# Altium project Eload Aux Supply Module Rev 2.PrjPcb
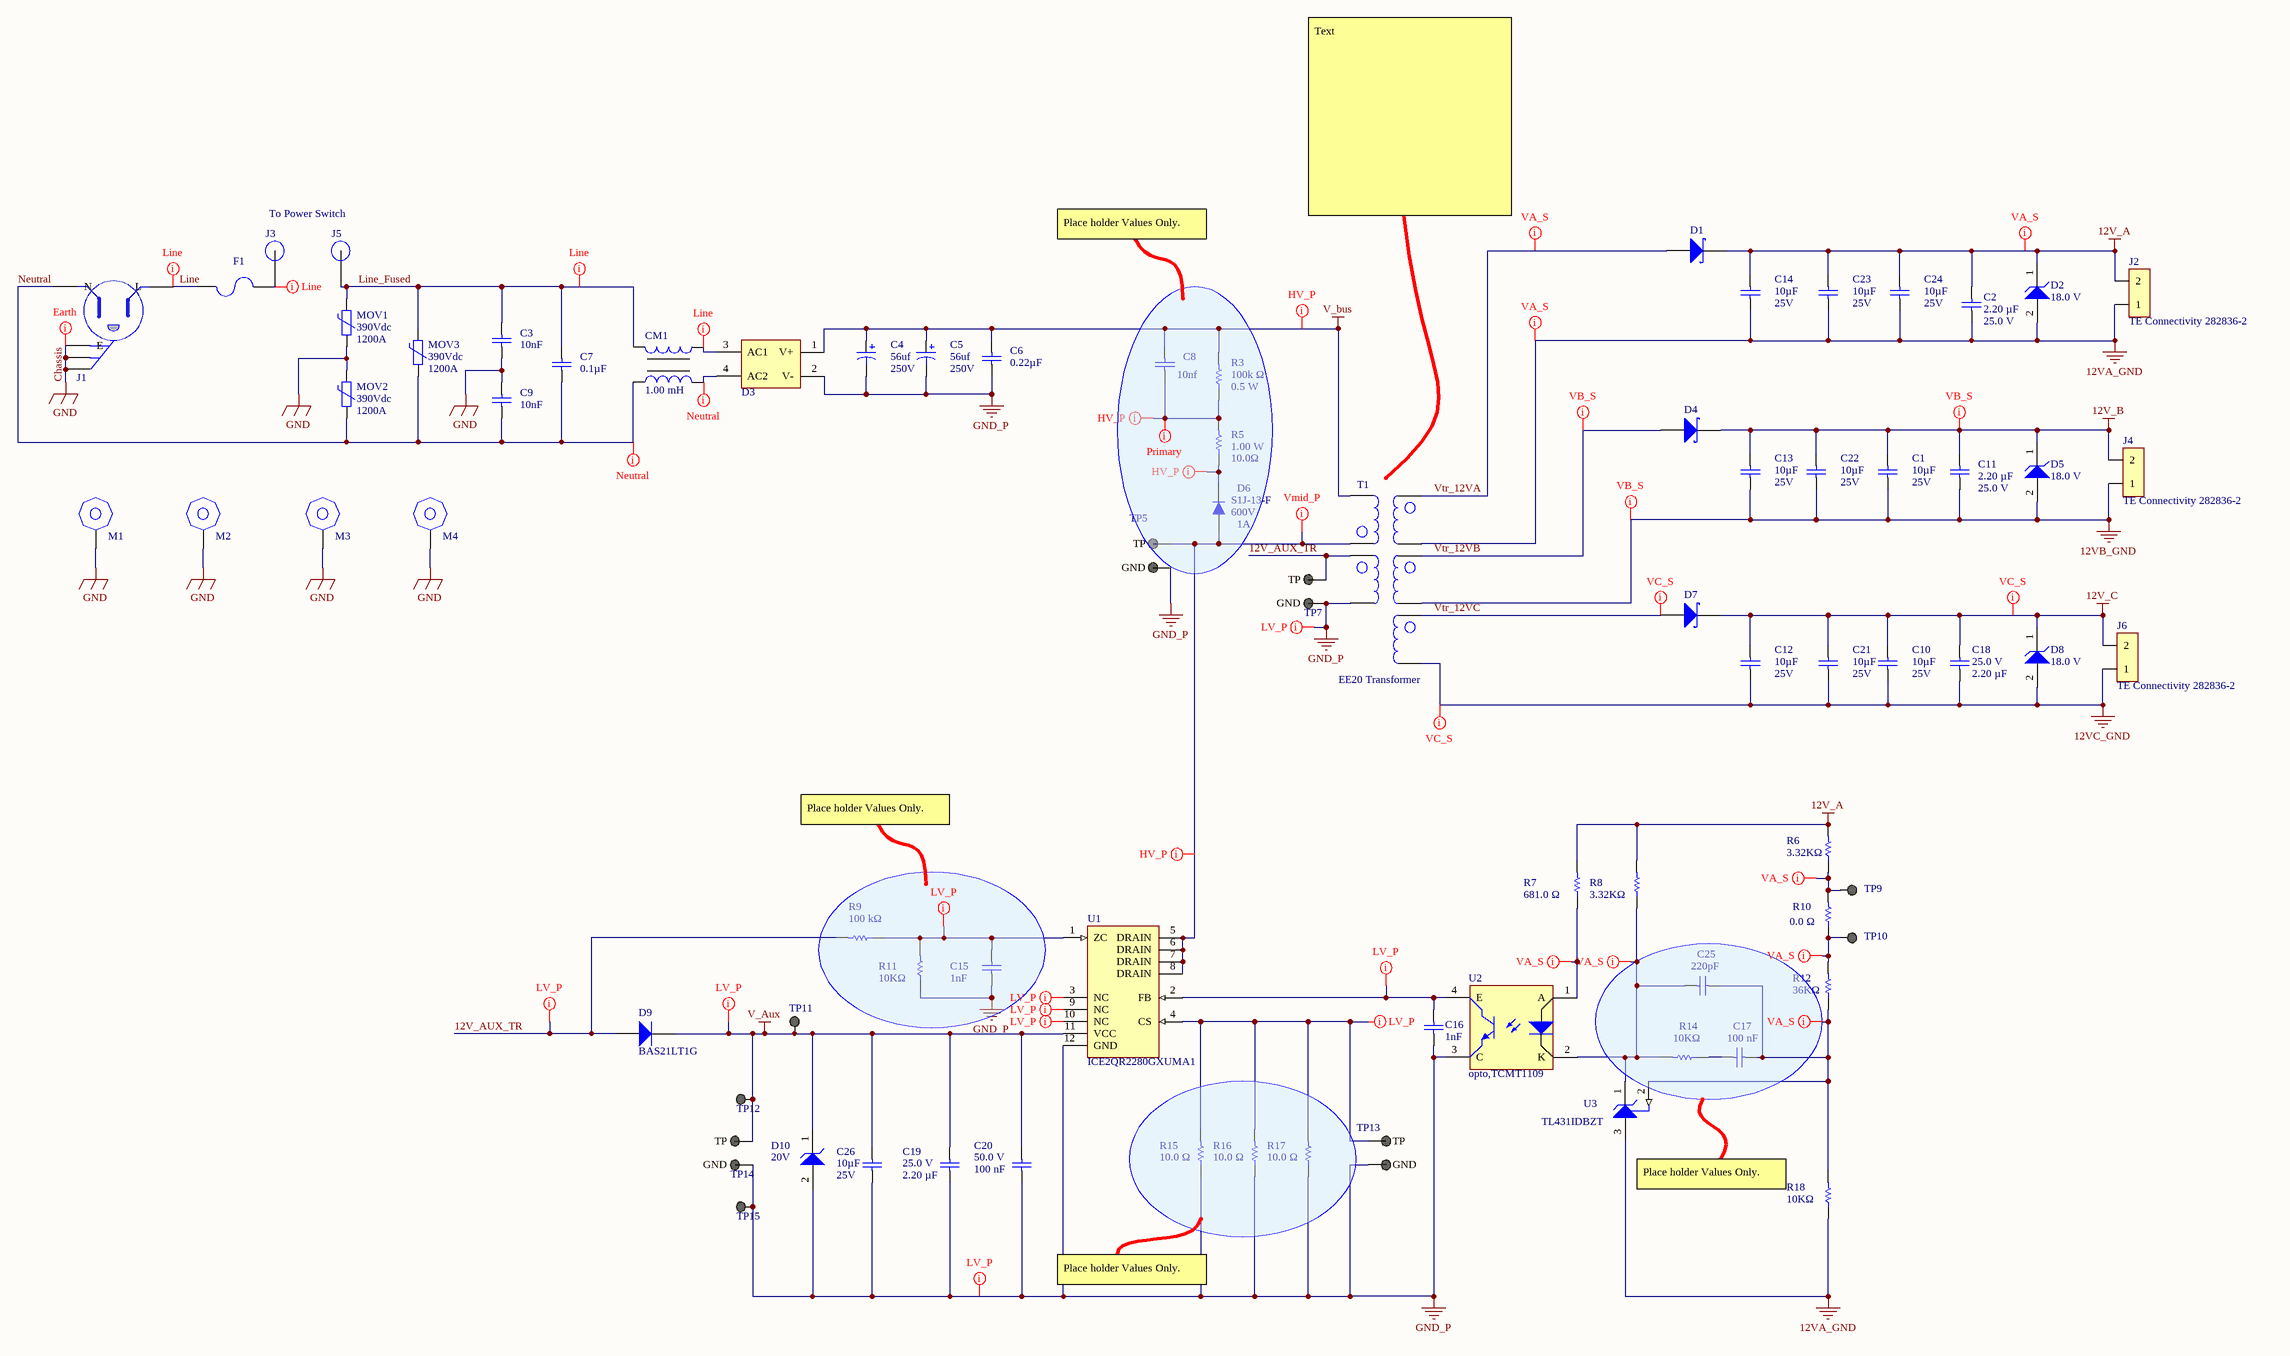
[diagram p0: Eload Aux Supply Module Rev 2.SchDoc]
1 sheet, 78 parts. Net scope: global (net labels, ports and power ports of the same name join across sheets).

## Sheet Eload Aux Supply Module Rev 2.SchDoc
size C

### Parts
C1  Capacitance: 10µF  Voltage - Rated: 25V  [Cap, 1206]  (hidden comment: Cap)
C2  Voltage Rating (DC): 25.0 V  Capacitance: 2.20 µF  [CAP, 0805, HD]  (hidden comment: AVX 08053C225KAT2A)
C3  Capacitance: 10nF  [Cap,7.5mm,RFI]  (hidden comment: Cap)
C4  Cap: 56uf  Voltage rating: 250V  [Cap, Rad, 5mmLead,12.5mmDia,Pin 2+]  (hidden comment: Cap,polar,through hole,12.5mm,56uf,250V,20%,UCY2E560MHD1TO)
C5  Cap: 56uf  Voltage rating: 250V  [Cap, Rad, 5mmLead,12.5mmDia,Pin 2+]  (hidden comment: Cap,polar,through hole,12.5mm,56uf,250V,20%,UCY2E560MHD1TO)
C6  Capacitance: 0.22µF  [Cap, 5mm Lead Spaceing, 4mm dai]  (hidden comment: Cap)
C7  Capacitance: 0.1µF  [CAP,RFI,15mm Lead Spaceing]  (hidden comment: Cap)
C8  10nf  [Cap, 5mm Lead Spaceing, 4mm dai]
C9  Capacitance: 10nF  [Cap,7.5mm,RFI]  (hidden comment: Cap)
C10  Capacitance: 10µF  Voltage - Rated: 25V  [Cap, 1206]  (hidden comment: Cap)
C11  Voltage Rating (DC): 25.0 V  Capacitance: 2.20 µF  [CAP, 0805, HD]  (hidden comment: AVX 08053C225KAT2A)
C12  Capacitance: 10µF  Voltage - Rated: 25V  [Cap, 1206]  (hidden comment: Cap)
C13  Capacitance: 10µF  Voltage - Rated: 25V  [Cap, 1206]  (hidden comment: Cap)
C14  Capacitance: 10µF  Voltage - Rated: 25V  [Cap, 1206]  (hidden comment: Cap)
C15  Capacitance: 1nF  [CAP, 0805, HD]  (hidden comment: Kemet C0805X102J1GACAUTO)
C16  Capacitance: 1nF  [CAP, 0805, HD]  (hidden comment: Kemet C0805X102J1GACAUTO)
C17  Capacitance: 100 nF  [CAP, 0805, HD]  (hidden comment: 08055C104JAT2A)
C18  Voltage Rating (DC): 25.0 V  Capacitance: 2.20 µF  [CAP, 0805, HD]  (hidden comment: AVX 08053C225KAT2A)
C19  Voltage Rating (DC): 25.0 V  Capacitance: 2.20 µF  [CAP, 0805, HD]  (hidden comment: AVX 08053C225KAT2A)
C20  Voltage Rating (DC): 50.0 V  Capacitance: 100 nF  [CAP, 0805, HD]  (hidden comment: 08055C104JAT2A)
C21  Capacitance: 10µF  Voltage - Rated: 25V  [Cap, 1206]  (hidden comment: Cap)
C22  Capacitance: 10µF  Voltage - Rated: 25V  [Cap, 1206]  (hidden comment: Cap)
C23  Capacitance: 10µF  Voltage - Rated: 25V  [Cap, 1206]  (hidden comment: Cap)
C24  Capacitance: 10µF  Voltage - Rated: 25V  [Cap, 1206]  (hidden comment: Cap)
C25  Capacitance: 220pF  [CAP, 0805, HD]  (hidden comment: CC0805KRX7R9BB221)
C26  Capacitance: 10µF  Voltage - Rated: 25V  [Cap, 1206]  (hidden comment: Cap)
CM1  Inductance: 1.00 mH  [Common mode inductor,TLF9UA102W0R8K1]  (hidden comment: KEMET SC-03-10G)
D1  NRVTSA4100ET3G  [DO-214AC, SMA]  (value not drawn)
D2  Voltage Rating (DC): 18.0 V  [SOD123]  (hidden comment: MMSZ4705T1G)
D3  Diode,Bridge, micro-dip,1A,600V, MDB6S  [Micro-DIP, 4-Leads]  (value not drawn)
D4  NRVTSA4100ET3G  [DO-214AC, SMA]  (value not drawn)
D5  Voltage Rating (DC): 18.0 V  [SOD123]  (hidden comment: MMSZ4705T1G)
D6  Manufacturer Part Number: S1J-13-F  Voltage - DC Reverse (Vr) (Max): 600V  Current: 1A  [DO-214AC, SMA]  (hidden comment: Diodes Inc. S1J-13-F)
D7  NRVTSA4100ET3G  [DO-214AC, SMA]  (value not drawn)
D8  Voltage Rating (DC): 18.0 V  [SOD123]  (hidden comment: MMSZ4705T1G)
D9  BAS21LT1G  [SOT23-3]
D10  Voltage - Zener (Nom) (Vz): 20V  [SOD123]  (hidden comment: MMSZ5250BT1G)
F1  Littelfuse 0461.500ER  [Fuse chip, SMD,9.4mm]  (value not drawn)
J1  Qualtek 703W-00/54  [conn, IEC320,703W-00/54]  (value not drawn)
J2  TE Connectivity 282836-2  [TERM BLOCK 2POS SIDE ENTRY 5MM]
J3  Wire Terminal,Quick connect, through hole, Keystone 1287-ST  [Quick connect terminal]  (value not drawn)
J4  TE Connectivity 282836-2  [TERM BLOCK 2POS SIDE ENTRY 5MM]
J5  Wire Terminal,Quick connect, through hole, Keystone 1287-ST  [Quick connect terminal]  (value not drawn)
J6  TE Connectivity 282836-2  [TERM BLOCK 2POS SIDE ENTRY 5MM]
M1  M3 hex Standoff  [Standoff,Hex,M3,8mm]  (value not drawn)
M2  M3 hex Standoff  [Standoff,Hex,M3,8mm]  (value not drawn)
M3  M3 hex Standoff  [Standoff,Hex,M3,8mm]  (value not drawn)
M4  M3 hex Standoff  [Standoff,Hex,M3,8mm]  (value not drawn)
MOV1  DC Clamping Voltage: 390Vdc  Clamping Current: 1200A  [MOV, 5mm spacing]  (hidden comment: MOV, though hole, 390V, 1.2kA, B72207S0251K101)
MOV2  DC Clamping Voltage: 390Vdc  Clamping Current: 1200A  [MOV, 5mm spacing]  (hidden comment: MOV, though hole, 390V, 1.2kA, B72207S0251K101)
MOV3  DC Clamping Voltage: 390Vdc  Clamping Current: 1200A  [MOV, 5mm spacing]  (hidden comment: MOV, though hole, 390V, 1.2kA, B72207S0251K101)
R3  Power Rating: 0.5 W  Resistance: 100k Ω  [Res,1210]  (hidden comment: Panasonic ERJ-14NF1003U)
R5  Power Rating: 1.00 W  Resistance: 10.0Ω  [Resistor,2010,1W]  (hidden comment: Bourns CRS2010-JX-100ELF)
R6  Resistance: 3.32KΩ  [res, 0805, HD]  (hidden comment: Vishay Dale CRCW08053K32FKEA)
R7  Resistance: 681.0 Ω  [res, 0805, HD]  (hidden comment: Vishay Dale CRCW0805681RFKEA)
R8  Resistance: 3.32KΩ  [res, 0805, HD]  (hidden comment: Vishay Dale CRCW08053K32FKEA)
R9  Resistance: 100 kΩ  [res, 0805, HD]  (hidden comment: Res,0805,100kΩ,1%,100ppm,CRCW0805100KFKEA)
R10  Resistance: 0.0 Ω  [res, 0805, HD]  (hidden comment: Vishay Dale CRCW08050000Z0EAHP)
R11  Resistance: 10KΩ  [res, 0805, HD]  (hidden comment: Vishay / Dale CRCW080510K0FKTA)
R12  Resistance: 36KΩ  [res, 0805, HD]  (hidden comment: Vishay Dale CRCW080536K0FKEA)
R14  Resistance: 10KΩ  [res, 0805, HD]  (hidden comment: Vishay / Dale CRCW080510K0FKTA)
R15  Resistance: 10.0 Ω  [Res,1210]  (hidden comment: RP73D2B10RBTG)
R16  Resistance: 10.0 Ω  [Res,1210]  (hidden comment: RP73D2B10RBTG)
R17  Resistance: 10.0 Ω  [Res,1210]  (hidden comment: RP73D2B10RBTG)
R18  Resistance: 10KΩ  [res, 0805, HD]  (hidden comment: Vishay / Dale CRCW080510K0FKTA)
T1  EE20 Transformer  [Transformer EE20, 10 Pos]
TP5  Scope Probe TP  [ScopeProbe_TP-Tektronix]  (value not drawn)  (no BOM)
TP7  Scope Probe TP  [ScopeProbe_TP-Tektronix]  (value not drawn)  (no BOM)
TP9  Keystone 5014  [Test Point, Keystone 5014]  (value not drawn)
TP10  Keystone 5014  [Test Point, Keystone 5014]  (value not drawn)
TP11  Keystone 5014  [Test Point, Keystone 5014]  (value not drawn)
TP12  Keystone 5014  [Test Point, Keystone 5014]  (value not drawn)
TP13  Scope Probe TP  [ScopeProbe_TP-Tektronix]  (value not drawn)  (no BOM)
TP14  Scope Probe TP  [ScopeProbe_TP-Tektronix]  (value not drawn)  (no BOM)
TP15  Keystone 5014  [Test Point, Keystone 5014]  (value not drawn)
U1  mfg P/N: ICE2QR2280GXUMA1  [SOP, 16-Leads]  (hidden comment: Infineon ICE2QR2280GXUMA1)
U2  opto,TCMT1109  [SSOP, 4-Leads]
U3  Manufacturer Part Number: TL431IDBZT  [SOT23-3]  (hidden comment: Shunt Regulator,2.5Vdc TL431IDBZT)

### Nets
12V_A: C2.2 C14.2 C23.2 C24.2 D1.1(K) D2.1(K) J2.2 R6.2 R7.2 R8.2
12V_B: C1.2 C11.2 C13.2 C22.2 D4.1(K) D5.1(K) J4.2
12V_C: C10.2 C12.2 C18.2 C21.2 D7.1(K) D8.1(K) J6.2
12VA_GND: C2.1 C14.1 C23.1 C24.1 D2.2(A) J2.1 R18.1 T1.5 U3.3(ANODE)
12VB_GND: C1.1 C11.1 C13.1 C22.1 D5.2(A) J4.1 T1.7
12VC_GND: C10.1 C12.1 C18.1 C21.1 D8.2(A) J6.1 T1.9
Chassis: C3.1 C9.2 J1.2(E) J1.4(E) J1.5(E) M1.0 M2.0 M3.0 M4.0 MOV1.1 MOV2.2  [also labelled GND]
GND_P: C4.1 C5.1 C6.1 C15.1 C16.1 C19.1 C20.1 C26.1 D3.2(V-) D10.2(A) R11.1 R15.1 R16.1 R17.1 T1.4 TP5.1(GND) TP7.1(GND) TP13.1(GND) TP14.1(GND) TP15.1 U1.12(GND) U2.3(C)
V_Aux: C19.2 C20.2 C26.2 D9.3(K) D10.1(K) TP11.1 TP12.1 TP14.2(TP) U1.11(VCC)
V_bus: C4.2 C5.2 C6.2 C8.2 D3.1(V+) R3.2 T1.1
12V_AUX_TR: D9.1(A) R9.2 T1.3 TP7.2(TP)
Line: F1.1 J1.1(L)
Line_Fused: C3.2 C7.2 CM1.3 J5.1 MOV1.2 MOV3.2
Neutral: C7.1 C9.1 CM1.1 J1.3(N) MOV2.1 MOV3.1
Vtr_12VA: D1.2(A) T1.6
Vtr_12VB: D4.2(A) T1.8
Vtr_12VC: D7.2(A) T1.10
NetC8_1: C8.1 R3.1 R5.2
NetC15_2: C15.2 R9.1 R11.2 U1.1(ZC)
NetC16_2: C16.2 U1.2(FB) U2.4(E)
NetC17_1: C17.1 C25.2 R12.1 R18.2 U3.2(REF)
NetC17_2: C17.2 R14.1
NetC25_1: C25.1 R8.1 R14.2 U2.2(K) U3.1(CATHODE)
NetCM1_2: CM1.2 D3.3(AC1)
NetCM1_4: CM1.4 D3.4(AC2)
NetD6_1: D6.1(A) T1.2 TP5.2(TP) U1.5(DRAIN) U1.6(DRAIN) U1.7(DRAIN) U1.8(DRAIN)
NetD6_2: D6.2(K) R5.1
NetF1_2: F1.2 J3.1
NetR6_1: R6.1 R10.2 TP9.1
NetR7_1: R7.1 U2.1(A)
NetR10_1: R10.1 R12.2 TP10.1
NetR15_2: R15.2 R16.2 R17.2 TP13.2(TP) U1.4(CS)

Not connected (* = marked no-connect by the designer): U1 3(NC) 9(NC) 10(NC)

### Layout directives
net class HV_P; net class Primary: NetC8_1, NetD6_1, NetD6_2, V_bus
net class LV_P; net class Primary: 12V_AUX_TR, GND_P, NetC15_2, NetC16_2, NetR15_2, NetU1_3, NetU1_9, NetU1_10, V_Aux
net class VB_S; net class Secondary: 12V_B, 12VB_GND, Vtr_12VB
net class VA_S; net class Secondary: 12V_A, 12VA_GND, NetC17_1, NetC25_1, NetR6_1, NetR7_1, NetR10_1, Vtr_12VA
net class Neutral; net class Primary; : Pri_Power: Neutral
net class VC_S; net class Secondary: 12V_C, 12VC_GND, Vtr_12VC
net class Primary; net class Primary: NetC8_1
net class Earth; net class Primary: Chassis
net class Vmid_P; net class Primary: NetD6_1
net class Line; net class Primary: NetCM1_2
net class Neutral; net class Primary: NetCM1_4
net class Line; net class Primary; net class Pri_Power: Line, Line_Fused, NetF1_2

### Notes on the sheet
- Text
- To Power Switch
- Place holder Values Only.

### Library data of the parts
C1 C10 C12-C14 C21-C24 C26 = CAP,1206,10uF,25V,C3216X7R1E106K160AB: 10µF ±10% 25V Ceramic Capacitor X7R 1206 (3216 Metric); Manufacturer: TDK Corporation; Features Low: ESL; mfg P/N: C3216X7R1E106K160AB; Tolerance: ±10%; Temperature Coefficient: X7R; Operating Temperature: -55°C ~ 125°C; Applications: General Purpose; Mounting Type: Surface Mount, MLCC; Package / Case: 1206 (3216 Metric); Size / Dimension: 0.126" L x 0.063" W (3.20mm x 1.60mm); Thickness (Max): 0.075" (1.90mm)
C2 C11 C18 C19 = Cap,0805,2.2uF,25V,±10%: 0805 2.2 uF 25 V ±10 % Tolerance X7R SMT Multilayer Ceramic Capacitor; Lead-Free Status: Lead Free; Case/Package (SI): 2012; Capacitance Tolerance: ±10%; REACH SVHC Compliance: No SVHC; Manufacturer Part Number: 08053C225KAT2A; Octopart URL: http://octopart.com/08053c225kat2a-avx-46506595; Case/Package: 0805; Mounting Style: Surface Mount; Dielectric Characteristic: X7R; RoHS: Compliant; Packaging: Cut Tape (CT), Tape & Reel (TR); Number of Pins: 2
C3 C9 = Cap,RFI,TH,7.5mm,10nF,300Vac,10nF,DE2F3KY103MN3AU02F: 10000pF ±20% 300VAC Ceramic Capacitor F Radial, Disc; Manufacturer: Murata Electronics North America; Ratings: X1, Y2; mfg P/N: DE2F3KY103MN3AU02F; Tolerance: ±20%; Voltage - Rated: 300VAC; Temperature Coefficient: F; Operating Temperature: -40°C ~ 125°C; Applications: Safety; Mounting Type: Through Hole; Package / Case: Radial, Disc; Size / Dimension: 0.551" Dia (14.00mm); Height - Seated (Max): 0.669" (17.00mm); Lead Spacing: 0.295" (7.50mm); Lead Style: Formed Leads
C4 C5 = Cap,polar,through hole,12.5mm,56uf,250V,20%,UCY2E560MHD1TO: Cap Alum 56uf 20% 250v Radial; Manufacturer Part Number: UCY2E560MHD1TO
C6 = Cap,TH,General Putpose,5mm Spacing, 220nF,250V,FG20X7R2E224KNT06: 0.22µF ±10% 250V Ceramic Capacitor X7R Radial; Manufacturer: TDK Corporation; mfg P/N: FG20X7R2E224KNT06; Tolerance: ±10%; Voltage - Rated: 250V; Temperature Coefficient: X7R; Operating Temperature: -55°C ~ 125°C; Applications: General Purpose; Mounting Type: Through Hole; Package / Case: Radial; Size / Dimension: 0.217" L x 0.157" W (5.50mm x 4.00mm); Height - Seated (Max): 0.276" (7.00mm); Lead Spacing: 0.197" (5.00mm); Lead Style: Formed Leads - Kinked
C7 = Cap,RFI,TH,15mm,100nF,305VAC,20%, B32922C3104M000: 0.1µF Film Capacitor 305V 630V Polypropylene (PP) Radial; Manufacturer: EPCOS (TDK); Tolerance: ±20%; Ratings: X2; mfg P/N: B32922C3104M000; Voltage Rating - AC: 305V; Voltage Rating - DC: 630V; Dielectric Material: Polypropylene (PP); Operating Temperature: O-40°C ~ 110°C; Mounting Type: Through Hole; Package / Case: Radial; Size / Dimension: 0.709" L x 0.197" W (18.00mm x 5.00mm); Height - Seated (Max): 0.413" (10.50mm); Termination: PC Pins; Lead Spacing: 0.591" (15.00mm); Applications: EMI, RFI Suppression
C8 = Cap,,snubber, 10nf,5mm,spacing,630,FG26C0G2J103JNT06: 10000pF ±5% 630V Ceramic Capacitor C0G, NP0 Radial; Capacitance: 10nf; Tolerance: ±5%; Voltage - Rated: 630V; Temperature Coefficient: C0G, NP0; Operating Temperature: -55°C ~ 125°C; Applications: General Purpose; Mounting Type: Through Hole; Package / Case: Radial; Size / Dimension 0: .217" L x 0.138" W (5.50mm x 3.50mm); Height - Seated (Max): 0.236" (6.00mm); Lead Spacing: 0.197" (5.00mm); Lead Style: Formed Leads - Kinked
C15 = Cap,0805n,1nF,±5%,100Vdc: CAPACITOR, 1NF, 100V, NP0, 0805; Capacitance Tolerance: ±5%; Dielectric Characteristic: C0G/NP0; Dielectric Material: Ceramic; Lead-Free Status: Lead Free; Voltage Rating (DC): 100.0 V; Case/Package: 0805; Mounting Style: Surface Mount; Octopart Url: https://octopart.com/c0805x102j1gacauto-kemet-23280135; Packaging: Cut Tape (CT); REACH SVHC Compliance: No SVHC; RoHS: Compliant; mfg P/N: C0805X102J1GACAUTO
C16 = Cap,0805,1nF,±5%,100Vdc: CAPACITOR, 1NF, 100V, NP0, 0805; Capacitance Tolerance: ±5%; Dielectric Characteristic: C0G/NP0; Dielectric Material: Ceramic; Lead-Free Status: Lead Free; Voltage Rating (DC): 100.0 V; Case/Package: 0805; Mounting Style: Surface Mount; Octopart Url: https://octopart.com/c0805x102j1gacauto-kemet-23280135; Packaging: Cut Tape (CT); REACH SVHC Compliance: No SVHC; RoHS: Compliant; mfg P/N: C0805X102J1GACAUTO
C17 = Cap,0805,100nf,50V,5%,08055C104JAT2A: Capacitor; Ceramic; Cap 0.1 uF; Tol 5%; Vol-Rtg 50 VDC; SMT; 0805; X7R; Tape & Reel; Lead-Free Status: Lead Free; Voltage Rating (DC): 50.0 V; Case/Package (SI): 2012; Insulation Resistance: 100 GΩ; Detailed Description: 0.1µF ±5% 50V Ceramic Capacitor X7R 0805 (2012 Metric); Mounting Style: Surface Mount; Packaging: Tape & Reel (TR), Cut Tape (CT); RoHS: Compliant; Size-Width: 1.24 mm; Case/Package: 0805; Number of Pins: 2; digikey url: http://www.digikey.ca/product-detail/en/avx-corporation/08055C104JAT2A/478-3352-1-ND/930144; REACH SVHC Compliance: No SVHC; Dielectric Characteristic: X7R; Capacitance Tolerance: ±5%; Size-Length: 2.01 mm; Size-Height: 710 µm; Size-Thickness: 940 µm; Manufacturer Part Number: 08055C104JAT2A; Octopart URL: http://octopart.com/08055c104jat2a-avx-55388010; Operating Temperature: -55°C ~ 125°C
C20 = Cap,0805,100nf,50V,5%,08055C104JAT2A: Capacitor; Ceramic; Cap 0.1 uF; Tol 5%; Vol-Rtg 50 VDC; SMT; 0805; X7R; Tape & Reel; Lead-Free Status: Lead Free; Case/Package (SI): 2012; Insulation Resistance: 100 GΩ; Detailed Description: 0.1µF ±5% 50V Ceramic Capacitor X7R 0805 (2012 Metric); Mounting Style: Surface Mount; Packaging: Tape & Reel (TR), Cut Tape (CT); RoHS: Compliant; Size-Width: 1.24 mm; Case/Package: 0805; Number of Pins: 2; digikey url: http://www.digikey.ca/product-detail/en/avx-corporation/08055C104JAT2A/478-3352-1-ND/930144; REACH SVHC Compliance: No SVHC; Dielectric Characteristic: X7R; Capacitance Tolerance: ±5%; Size-Length: 2.01 mm; Size-Height: 710 µm; Size-Thickness: 940 µm; Manufacturer Part Number: 08055C104JAT2A; Octopart URL: http://octopart.com/08055c104jat2a-avx-55388010; Operating Temperature: -55°C ~ 125°C
C25 = Cap,0805,220pf,50V,5%,CC0805KRX7R9BB221: 220pF ±10% 50V Ceramic Capacitor X7R 0805 (2012 Metric); Manufacturer: Yageo; Lead-Free Status: Lead Free; Voltage Rating (DC): 250.0 V; Capacitance Tolerance: ±10%; Case/Package: 0805; RoHS: Compliant; Size-Length: 0.002 m; Size-Thickness: 0.001 m; Size-Width: 0.00125 m; Voltage - Rated: 50V; Temperature Coefficient: X7R; Operating Temperature: -55°C ~ 125°C; Features: High Voltage; Applications: General Purpose; Mounting Type: Surface Mount, MLCC; Package / Case: 0805 (2012 Metric); mfg P/N: CC0805KRX7R9BB221
CM1 = common mode, 1mH,800mA,TLF9UA102W0R8K1: CMC 1MH 800MA 2LN TH; Lead-Free Status: Lead Free; Manufacturer Part Number: SC-03-10G; Mounting Style: Through Hole; RoHS: Compliant; Current Rating: 800mA
D1 D4 D7 = Dio,Schottky,4A,400V,NRVTSA4100ET3G: Trench Schottky Rectifier, Very Low Leakage, 100V, 4A; Manufacturer: ON Semiconductor; Voltage - Forward (Vf) (Max) @ If: 680mV @ 4A; Speed: Fast Recovery =< 500ns, > 200mA (Io); Current - Reverse Leakage @ Vr: 9µA @ 100V; Capacitance @ Vr, F: 55pF @ 4V, 1MHz; mfg P\N: NRVTSA4100ET3G; Diode Type: Schottky; Voltage - DC Reverse (Vr) (Max): 100V; Current - Average Rectified (Io): 4A; Mounting Type: Surface Mount; Package / Case: DO-214AC, SMA; Supplier Device Package: SMA; Operating Temperature - Junction: -55°C ~ 175°C
D2 D5 D8 = diode,Zener, 18V,500mW, SOD123,MMSZ4705T1G: Zener Diode 18V 500mW ±5% Surface Mount SOD-123; Manufacturer: ON Semiconductor; Lead-Free Status: Lead Free; Material: Plastic; Power Rating: 0.5 W; Current - Reverse Leakage @ Vr: 50nA @ 13.6V; Voltage - Forward (Vf) (Max) @ If: 900mV @ 10mA; Case/Package: SOD-123; Lifecycle Status: Active; Mounting Style: Surface Mount; Number of Pins: 2; REACH SVHC Compliance: No SVHC; RoHS: Compliant; Operating Temperature: -55°C ~ 150°C; mfg P/N: MMSZ4705T1G
D3 = Diode,Bridge, micro-dip,1A,600V, MDB6S: 600 V, 1 A, Single-Phase Bridge Rectifier, -55 to 150 degC, 4-Pin 5 x 4.4 x 1.6 mm MicroDIP, RoHS, Tape and Reel; Lead-Free Status: Lead Free; Lifecycle Status: Active; Mounting Style: Surface Mount; RoHS: Compliant; Supplier 1: Digi-Key; Supplier Part Number 1: MDB6SFSCT-ND
D6 = Dio, 1A,600V,S1J-13-F: S1J Series 600 V 1 A Surface Mount Glass Passivated Rectifier - DO-214AC; Vforward: 1.1@1A; Reverse recovery time: 3us; Capacitance @ Vr, F: 10pF @ 4V, 1MHz; Speed: Standard Recovery >500ns, > 200mA (Io); Diode Type: Standard; Package / Case: DO-214AC, SMA; Operating Temperature - Junction: -65°C ~ 150°C
D9 = Diode, SOT23,200mA,250V,BAS21LT1G: Diode Standard 250V 200mA (DC) Surface Mount SOT-23-3 (TO-236); Manufacturer: ON Semiconductor; Detailed Description: Diode Standard 250V 200mA Surface Mount SOT-23-3 (TO-236); Voltage - Forward (Vf) (Max) @ If: 1.25V @ 200mA; Speed: Small Signal =< 200mA (Io), Any Speed; Reverse Recovery Time (trr): 50ns; Current - Reverse Leakage @ Vr: 100nA @ 200V; Capacitance @ Vr, F: 5pF @ 0V, 1MHz; mfg P/N: BAS21LT1G; Diode Type: Standard; Voltage - DC Reverse (Vr) (Max): 250V; Current - Average Rectified (Io): 200mA (DC); Mounting Type: Surface Mount; Package / Case: TO-236-3, SC-59, SOT-23-3; Supplier Device Package: SOT-23-3 (TO-236); Operating Temperature - Junction: -55°C ~ 150°C; Base Part Number: BAS21L; Supplier 1: LCSC; Supplier Part Number 1: C79596; Supplier 2: Digi-Key; Supplier Part Number 2: BAS21LT1GOSCT-ND
D10 = Diode,zener,SOD-123,20V,500mW,MMSZ5250BT1G: DIODE ZENER 20V 500MW SOD123; Lead-Free Status: Lead Free; Material: Plastic; Detailed Description: Zener Diode 20V 500mW ±5% Surface Mount SOD-123; Tolerance: ±5%; Impedance (Max) (Zzt): 25 Ohms; Current - Reverse Leakage @ Vr: 100nA @ 15V; Voltage - Forward (Vf) (Max) @ If: 900mV @ 10mA; Power Rating: 0.5 W; Case/Package: SOD-123; Lifecycle Status: Active; Mounting Style: Surface Mount; Number of Pins: 2; REACH SVHC Compliance: No SVHC; RoHS: Compliant; mfg P/N: MMSZ5250BT1G; Operating Temperature: -55°C ~ 150°C; Package / Case: SOD-123; Mounting Type: Surface Mount
F1 = Fuse,500mA,600V,SMD,0461.500ER: Fuse Chip Slow Blow Acting 0.5A 600V SMD Solder Pad 10.1 X 3.12 X 3.12mm Ceramic T/R; Voltage Rating (DC): 250.0 V; Voltage Rating (AC): 600Vac; Lead-Free Status: Lead Free; RoHS: Compliant; Manufacturer Part Number: 0461.500ER; Size-Width: 0.00312 m; Mounting Style: Surface Mount; Packaging: Cut Tape (CT); Size-Height: 0.00312 m; REACH SVHC Compliance: No SVHC; Size-Length: 0.0100838 m; Supplier 1: Newark; Supplier 2: Farnell; Supplier 3: Farnell; Supplier 4: Farnell; Supplier 5: Allied; Supplier 6: Digi-Key; Supplier 7: Farnell; Supplier 8: Digi-Key; Supplier 9: Digi-Key; Supplier 10: Newark; Supplier 11: Farnell; Supplier 12: Digi-Key; Supplier 13: Farnell; Supplier 14: Digi-Key; Supplier 15: Digi-Key; Supplier 16: Newark
J1 = Conn,RCPT,IEC320-C14,703W-00/54: Inlet, Power; PCB Mount; 250 VAC; 12-15A; Nylon; Black; Current - IEC: 10A; Filter Type: Unfiltered - Commercial; Number of Positions: 3; Panel Thickness: 0.120" (3.00mm); Approvals: CSA, UL, VDE; Connector Type: Receptacle, Male Blades; Voltage - IEC: 250VAC; Current - UL: 15A; Fuse: No; mfg P/N: 703W-00/54; Manufacturer: Qualtek; Part Status: Active; Connector Style: IEC 320-C14; Voltage - UL: 250VAC; Mounting Type: Panel Mount, Flange; Through Hole, Right Angle; Termination: Solder; Panel Cutout Dimensions: Rectangular - 31.10mm x 23.30mm
J2 J4 J6 = TERM BLOCK 2POS SIDE ENTRY 5MM, 282836-2: Wire to Board 2 Position 5 mm Pitch 30-16 AWG Euro Style Terminal Block; Voltage Rating (AC): 250.0 V; ELV Compliant: Compliant; Current Rating: 13.5 A; Number of Contacts: 2; Pin Pitch: 0.005 m; Lead-Free Status: Lead Free; Wire Gauge: 15.0 AWG; RoHS: Compliant; Contact Material: Brass; Contact Plating: Tin; Color: Green; Manufacturer Part Number: 282836-2; Flammability Rating: UL 94 V-0; Mounting Style: PCB; Housing Material: Nylon 6/6; Insulation Material: Nylon; Housing Color: Green; Orientation: Right Angle; Lifecycle Status: Active; REACH SVHC Compliance: No SVHC; Number of Positions: 2; Supplier 1: TME; Supplier 2: Newark; Supplier 3: Digi-Key
J3 J5 = Wire Terminal,Quick connect, through hole, Keystone 1287-ST: Brass Tin Plate Vertical .250 inch Tab Sturdi-Mount Male Quick-Fit Terminal; Tab Width: 0.250" (6.35mm); Tab Thickness: 0.032" (0.81mm); Tab Length: 0.312" (7.92mm); Insulation: Non-Insulated; mfg P/N: 1287-ST; Terminal Type: Standard; Gender: Male; Length - Overall: 0.552" (14.02mm); Termination: Solder; Mounting Type: Through Hole; Contact Material: Brass; Contact Finish: Tin
M1-M4 = Standoff, M3, Hex: HEX STANDOFF M3,generic
MOV1-MOV3 = MOV, though hole, 390V, 1.2kA, B72207S0251K101: 390V 1.2kA Varistor 1 Circuit Through Hole Disc 7mm; Lead-Free Status: Lead Free; Maximum AC Volts: 250Vac; Maximum DC Volts: 320V; Varistor Voltage (Min): 351V; Varistor Voltage (Max): 429V; Energy: 19J; Capacitance @ Frequency: 65pF @ 1kHz; Mounting Style: Through Hole; mfg P/N: B72207S0251K101; RoHS: Compliant; Octopart URL: http://octopart.com/b72207s251k101-epcos-2640242; Varistor Voltage (Typ): 390V; Operating Temperature: -40°C ~ 105°C (TA); Mounting Type: Through Hole; Package / Case: Disc 7mm
R3 = Res,1210,100K,1%,0.5W,200V: Thick Film Resistors - SMD 1210 100Kohms 1% Tol; Lead-Free Status: Lead Free; Voltage Rating (DC): 200.0 V; Case/Package: 1210; Lifecycle Status: Not Listed by Manufacturer; Mounting Style: Surface Mount; Octopart Url: https://octopart.com/erj-14nf1003u-panasonic-55419081; Packaging: Cut Tape (CT); REACH SVHC Compliance: No SVHC; Resistance Tolerance: ±1%; RoHS: Compliant; Size-Height: 0.0006 m; Size-Length: 0.0032 m; Size-Width: 0.0025 m
R5 = Res,2010,10.0Ω,±5%,1W,400V: Surface Mount Chip Resistor, Thick Film, CRS Series, 10 ohm, 1 W, 5%, 400 V, 2010 [5025 Metric]; Voltage Rating (DC): 400 V; Octopart URL: http://octopart.com/crs2010-jx-100elf-bourns-55399185; Manufacturer Part Number: CRS2010-JX-100ELF; REACH SVHC Compliance: No SVHC; RoHS: Compliant; Resistance Tolerance: ±5%; Packaging: Cut Tape (CT); Case/Package: 2010; OctopartID: 196dd32a6f1ac6aa
R6 R8 = Res,0805,3.32K,±1%,100.0 ppm/°C,150.0 V,CRCW08053K32FKEA: RES SMD 3.32K OHM 1% 1/8W 0805; Case/Package (SI): 2012; Lead-Free Status: Lead Free; Power Rating: 0.125 W; Voltage Rating (DC): 150.0 V; Case/Package: 0805; Mounting Style: Surface Mount; Number of Pins: 2; Octopart Url: https://octopart.com/crcw08053k32fkea-vishay-39436860; REACH SVHC Compliance: No SVHC; Resistance Tolerance: ±1%; RoHS: Compliant; Size-Height: 0.00045 m; Size-Length: 0.002 m; Size-Width: 0.00125 m; Temperature Coefficient: 100.0 ppm/°C; mfg P/N: CRCW08053K32FKEA
R7 = Res,0805,681.0 Ω,±1%,100.0 ppm/°C,150.0 V,CRCW0805681RFKEA: RES SMD 681 OHM 1% 1/8W 0805; Case/Package (SI): 2012; Lead-Free Status: Lead Free; Power Rating: 0.125 W; Voltage Rating (DC): 150.0 V; Case/Package: 0805; Mounting Style: Surface Mount; Number of Pins: 2; Octopart Url: https://octopart.com/crcw0805681rfkea-vishay-39820193; REACH SVHC Compliance: No SVHC; Resistance Tolerance: ±1%; RoHS: Compliant; Size-Height: 0.00045 m; Size-Length: 0.002 m; Size-Width: 0.00125 m; Temperature Coefficient: 100.0 ppm/°C; mfg P/N: CRCW0805681RFKEA
R9 = Res,0805,100kΩ,1%,100ppm,CRCW0805100KFKEA: 100 kOhms ±1% 0.125W, 1/8W Chip Resistor 0805 (2012 Metric) Thick Film; Manufacturer: Vishay; Lead-Free Status: Lead Free; Case/Package (SI): 2012; Power Rating: 125 mW; Temperature Coefficient: -100 ppm/°C to 100 ppm/°C; Resistance Tolerance: ±1%; RoHS: Compliant; Manufacturer Part Number: CRCW0805100KFKEA; Number of Pins: 2; Size-Length: 2.00 mm; Packaging: Tape & Reel (TR), Reel, Cut Tape (CT); Size-Height: 450 µm; Case/Package: 0805; Size-Width: 1.25 mm; Operating Temperature: 150 °C (max); Supplier 1 Part Number: 679-0803; Supplier 1: RS
R10 = Res,0805,0.0Ω,150V: RES SMD 0.0 OHM JUMPER 1/3W 0805; Lead-Free Status: Lead Free; Power Rating: 0.125 W; Voltage Rating (DC): 150.0 V; Case/Package: 0805; Number of Pins: 2; Octopart Url: https://octopart.com/crcw08050000z0eahp-vishay-44321084; RoHS: Compliant
R11 R14 R18 = Res,0805,10.0kΩ,1%,100 ppm,CRCW080510K0FKTA: RES SMD 10K OHM 1% 1/8W 0805; Temperature Coefficient: 100.0 ppm/C; Lead-Free Status: Contains Lead; Voltage Rating (DC): 150.0 V; Power Rating: 0.125 W; Case/Package (SI): 2012; Size-Width: 0.00125 m; Resistance Tolerance: 1%; Size-Length: 0.002 m; RoHS: Non-Compliant; Power Dissipation: 0.125 W; Number of Pins: 2; REACH SVHC Compliance: No SVHC; Size-Height: 0.00045 m; Case/Package: 0805; Mounting Style: Surface Mount
R12 = Res,0805,36KΩ,1 %,100ppm,150 V,CRCW080536K0FKEA: RES SMD 36K OHM 1% 1/8W 0805; Brand: Vishay / Dale; Voltage Rating: 150 V; Case Height: 0.45 mm; Case Length: 2 mm; Power Rating: 125 mW (1/8 W); Unit Weight: 0.000194 oz; CiivaID: 1867605; Case Width: 1.25 mm; Temperature Coefficient: 100 PPM / K; Operating Temperature Range: - 55 C to + 155 C; Termination Style: SMD/SMT; Manufacturer: Vishay; Product Category: Thick Film Resistors - SMD; Case Code - in: 0805; Tolerance: 1 %; Packaging: Reel; Factory Pack Quantity: 5000; Dimensions: 1.25 mm W x 2 mm L x 0.45 mm H; Ciiva URL: https://ciiva.com/part/crcw080536k0fkea-1867605; Package / Case: 0805 (2012 metric); Case Code - mm: 2012; mfg P\N: CRCW080536K0FKEA; Series: CRCW; Product: Thick Film Resistors SMD; RoHS: Details
R15-R17 = Res,1210,10.0 Ω,±0.1%,200V,RP73D2B10RBTG: Surface Mount Thin Film Resistor, RP73 Series, 10 ohm, 250 mW, - 0.1%, 200 V; Power Rating: 250 mW; ELV Compliant: Compliant; Voltage Rating (DC): 200 V; RoHS: Compliant; Packaging: Cut Tape (CT); Lifecycle Status: Active; Octopart URL: http://octopart.com/rp73d2b10rbtg-te+connectivity+%2F+holsworthy-42012238; Number of Pins: 2; REACH SVHC Compliance: No SVHC; Manufacturer Part Number: RP73D2B10RBTG; Resistance Tolerance: ±0.1%; Case/Package: 1206
T1 = Transformer E20-10-6 Vertical: EE20 Transformer Assembly; Bobbin: B66206W1110T001; Mfg P/N: Custom Part; Ferrite: N97
TP5 TP7 TP13 TP14 = Test Point, Tektronix Scope Probe Short Lead Test Point: Tektronix Scope Probe Short Lead Test Point
TP9-TP12 TP15 = Test Point; Yellow; Thru-Hole; Snap-Fit,Keystone   5014: Test Point; Yellow; Thru-Hole; Snap-Fit; SilverPlate; 0.063in. Dia.; 0.445In.; Manufacturer Part Number: 5014; Gender: Male; Lead-Free Status: Lead Free; Size-Height: 11.3 mm; Contact Plating: Tin; Packaging: Bulk; RoHS: Compliant; Color: Yellow; Size-Diameter: 3.18 mm; Material: Aluminum; Octopart URL: http://octopart.com/5014-keystone-63951; Size-Length: 11.3 mm; Size-Inner Diameter: 1.78 mm; Mounting Style: Through Hole, PCB; Contact Material: Phosphor Bronze
U1 = controller, flyback, QR, ICE2QR2280GXUMA1: Off Line SMPS Quasi-Resonant PWM Controller 12-Pin DSO T/R; Detailed Description: Converter Offline Flyback Topology 52kHz PG-DSO-12; Output Isolation: Isolated; Internal Switch(s): Yes; Voltage - Breakdown: 800V; Voltage - Start Up: 18V; Voltage - Supply (Vcc/Vdd): 10.5 V ~ 27 V; Duty Cycle: 50%; Frequency - Switching: 52kHz; Power (Watts): 53W; Fault Protection: Current Limiting, Over Load, Over Temperature, Over Voltage; Packaging: Tape & Reel (TR); Mounting Style: Surface Mount; Topology: Flyback; Operating Temperature: -40°C ~ 150°C (TJ); Package / Case: 12-BSOP (0.295", 7.50mm Width); Supplier Device: Package PG-DSO-12; Mounting Type: Surface Mount
U2 = opto,TCMT1109: Optocoupler DC-IN 1-CH Transistor DC-OUT 4-Pin Mini-Flat T/R; Input Current: 0.06 A; Isolation Voltage: 3750.0 V; Lead-Free Status: Lead Free; Number of Channels: 1; Output Voltage: 70.0 V; Mounting Style: Surface Mount; Number of Pins: 4; Packaging: Tape & Reel (TR); REACH SVHC Compliance: No SVHC; RoHS: Compliant; Voltage Rating (DC): 70.0 V
U3 = Shunt Regulator,2.5Vdc TL431IDBZT: Adjustable Precision Shunt Regulator, 34 ppm / degC, 100 mA, -40 to 85 degC, 3-pin SOT-23 (DBZ), Green (RoHS & no Sb/Br); Lead-Free Status: Lead Free; Output Current: 0.1 A; Temperature Coefficient: 34.0 ppm/°C; Case/Package: SOT-23; Lifecycle Status: Active; Number of Pins: 3; Octopart Url: https://octopart.com/tl431idbzt-texas+instruments-843706; OctopartID: acb465b256687373; Packaging: Cut Tape (CT); RoHS: Compliant